# Altium schematic sheet 接线图.SchDoc
size A4
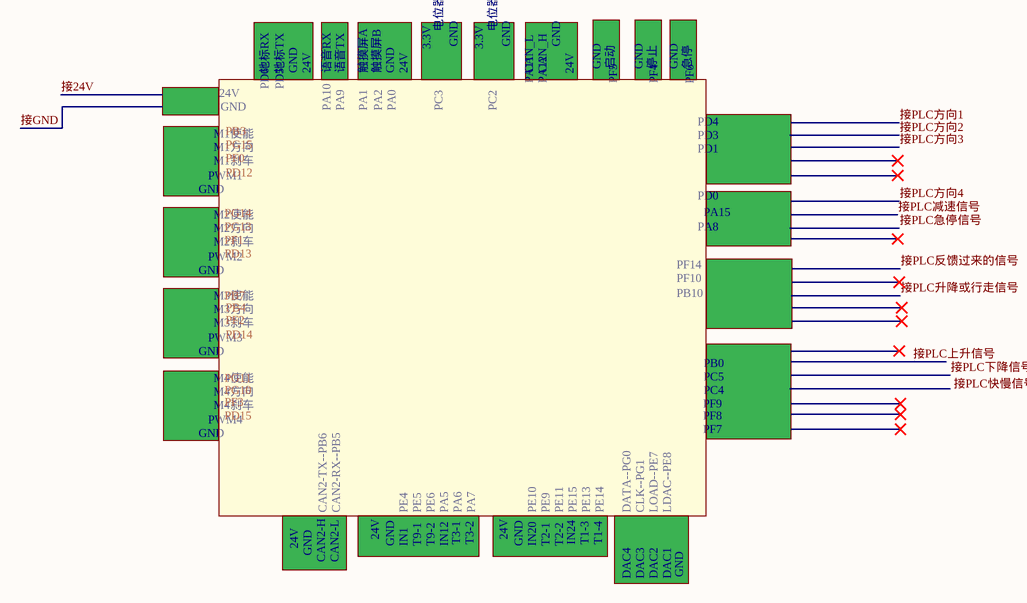
[diagram p0: 接线图.SchDoc]

## Buses and harness runs
bus 接24V
bus 接GND
bus 接PLC上升信号
bus 接PLC下降信号
bus 接PLC减速信号
bus 接PLC升降或行走信号
bus 接PLC反馈过来的信号
bus 接PLC急停信号
bus 接PLC方向1
bus 接PLC方向2
bus 接PLC方向3
bus 接PLC方向4

## Notes on the sheet
- 地标RX
- PD6
- 地标TX
- PD5
- GND
- 24V
- 语音RX
- 语音TX
- 触摸屏A
- 触摸屏B
- 3.3V
- 电位器1
- 电位器2
- CAN_L
- PA11
- CAN_H
- PA12
- 启动
- PF5
- 停止
- PF4
- 急停
- PF6
- M1使能
- M1方向
- PA10
- PA9
- PA1
- PA2
- PA0
- PC3
- PC2
- PD3
- PD4
- PD1
- PWM1
- M1刹车
- M2使能
- PD0
- PA15
- PWM2
- M2方向
- M2刹车
- PF10
- PF14
- PA8
- PWM3
- M3使能
- M3方向
- M3刹车
- PB10
- PWM4
- M4使能
- M4方向
- M4刹车
- PF8
- PF9
- PC4
- PC5
- PB0
- PF7
- CAN2-H
- CAN2-TX--PB6
- CAN2-L
- CAN2-RX--PB5
- PE4
- IN1
- PE5
- T9-1
- PE6
- T9-2
- PA5
- IN12
- T3-1
- PA6
- T3-2
- PA7
- PE10
- IN20
- PE9
- T2-1
- PE11
- T2-2
- IN24
- PE15
- T1-3
- PE13
- T1-4
- PE14
- DATA--PG0
- CLK--PG1
- LOAD--PE7
- LDAC--PE8
- DAC4
- DAC3
- DAC2
- DAC1
- Labels drawn without touching a wire or pin: PB3, PB4, PB7, PD12, PD13, PD14, PD15, PF0, PF1, PF2, PF3, PG10, PG11, PG13, PG14, PG15, 接PLC快慢信号